# Altium schematic sheet Regulador 3v3.SchDoc
size A
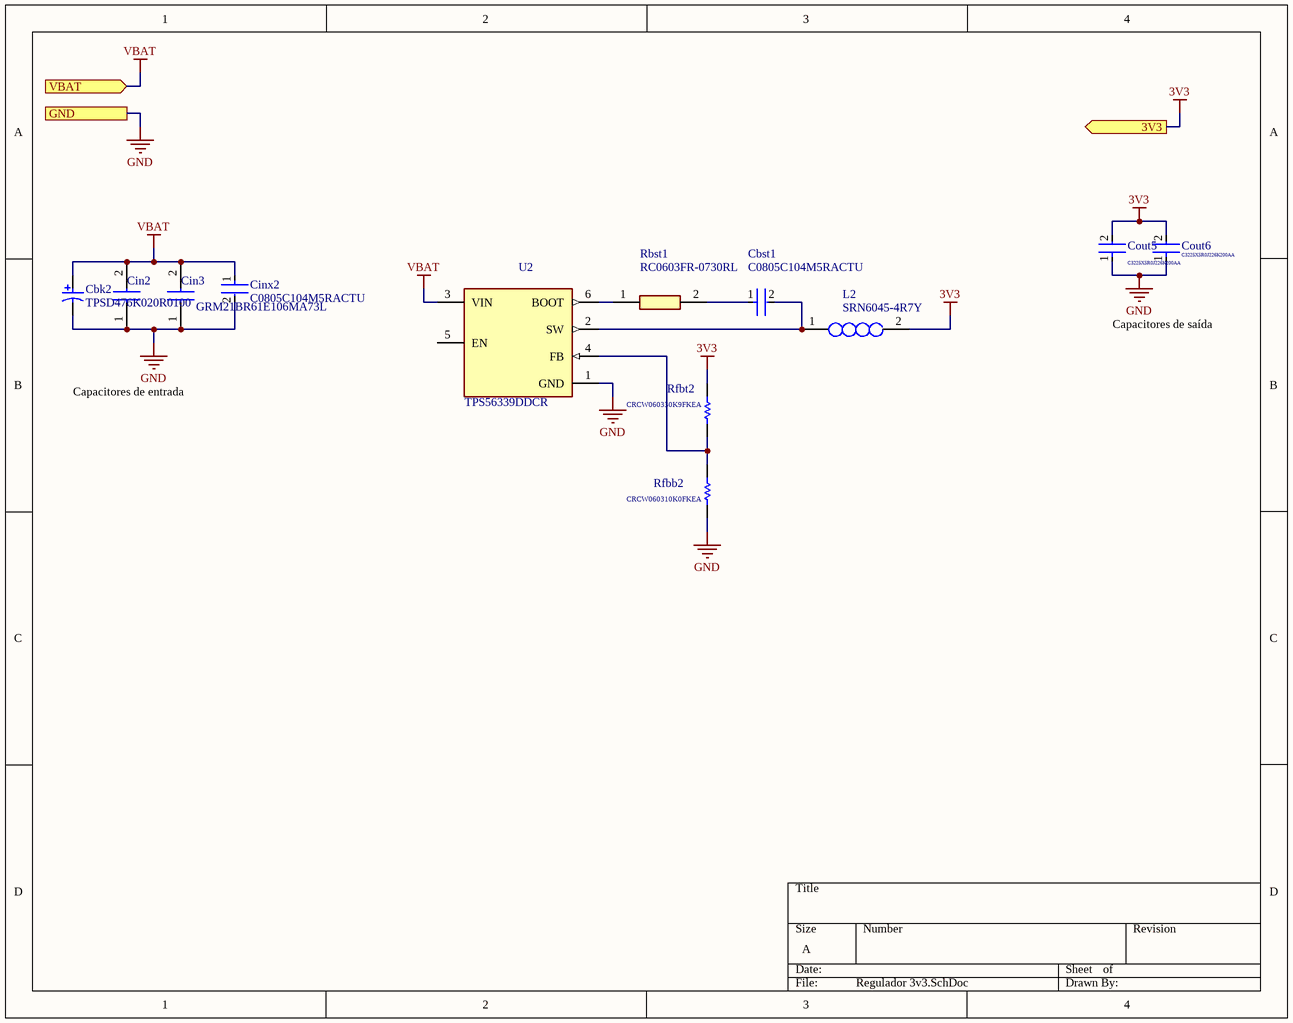
[diagram p0: Regulador 3v3.SchDoc]

## Parts
Cbk2  TPSD476K020R0100  [TPSD476K020R0100]
Cbst1  C0805C104M5RACTU  [FP-C0805C-DN-MFG]
Cin2  GRM21BR61E106MA73L  [CAPC2012X145N]  (value not drawn)
Cin3  GRM21BR61E106MA73L  [CAPC2012X145N]
Cinx2  C0805C104M5RACTU  [FP-C0805C-DN-MFG]
Cout5  C3225X5R0J226K200AA  [FP-C3225-200-0_4-IPC_C]
Cout6  C3225X5R0J226K200AA  [FP-C3225-200-0_4-IPC_C]
L2  SRN6045-4R7Y  [SRN6045_1]
Rbst1  RC0603FR-0730RL  [RESC1608X55N]
Rfbb2  CRCW060310K0FKEA  [RESC1609X50X30NL8T20]
Rfbt2  CRCW060330K9FKEA  [RESC1609X50X30LL10T20]
U2  TPS56339DDCR  [FP-DDC0006A-MFG]

## Ports
3V3 (out), GND, VBAT (in)

## Nets
3V3: Cout5.2 Cout6.2 L2.2 Rfbt2.2 ; port 3V3
GND: Cbk2.2 Cin2.1 Cin3.1 Cinx2.2 Cout5.1 Cout6.1 Rfbb2.2 U2.1(GND) ; port GND
VBAT: Cbk2.1 Cin2.2 Cin3.2 Cinx2.1 U2.3(VIN) ; port VBAT
NetCbst1_1: Cbst1.1 Rbst1.2
NetCbst1_2: Cbst1.2 L2.1 U2.2(SW)
NetRbst1_1: Rbst1.1 U2.6(BOOT)
NetRfbb2_1: Rfbb2.1 Rfbt2.1 U2.4(FB)

Not connected (* = marked no-connect by the designer): U2 5(EN)

## Notes on the sheet
- Capacitores de saída
- Capacitores de entrada

## Library data of the parts
Cbk2 = TPSD476K020R0100: CAP TANT 47UF 20V 10% 2917; Manufacturer: Kyocera AVX; Dielectric Material: Tantalum; ESR (Equivalent Series Resistance): 100mR; Leakage Current: 9.4uA; Polarity: Polar; Dissipation Factor: 6%; Ripple Current: 490uA; Supplier 1: Arrow Electronics; Manufacturer Part Number: TPSD476K020R0100; RoHS: Yes; Category: Tantalum Capacitors; Stock 1: 2; Pricing 1: 1=1.88550, 10=1.55250, 25=1.53920, 50=1.52390, 100=1.08810, 1000=1.02300 (USD); Mount: Surface Mount; Case/Package: 2917; Weight: 0.023634oz; Case Code (Imperial): 2917; Case Code (Metric): 7343; Min Operating Temperature: -55°C; Max Operating Temperature: 125°C; Capacitance: 47uF; Tolerance: 10%; Termination: SMD/SMT; Voltage: 20V; Features: General Purpose; Packaging: Tape and Reel; Voltage Rating: 20V; Package Quantity: 1; Length: 7.3mm; Height: 2.9mm; Depth: 4.3mm; Height - Seated (Max): 0.122inch; Width: 4.3mm; Radiation Hardening: No; REACH SVHC: No SVHC; Lead Free: Lead Free; ComponentLink1URL: https://datasheet.ciiva.com/11794/0900766b80962b61-11794592.pdf?src-supplier=RSComponents; ComponentLink1Description: https://datasheet.ciiva.com/11794/0900766b80962b61-11794592.pdf?src-supplier=RSComponents; ComponentLink2URL: https://datasheet.ciiva.com/39121/1154520-39121511.pdf?src-supplier=Jameco; ComponentLink2Description: https://datasheet.ciiva.com/39121/1154520-39121511.pdf?src-supplier=Jameco; ComponentLink3URL: https://datasheet.ciiva.com/26787/tpsd476k020r0100-26787068.pdf?src-supplier=IIIC; ComponentLink3Description: https://datasheet.ciiva.com/26787/tpsd476k020r0100-26787068.pdf?src-supplier=IIIC; ComponentLink4URL: https://datasheet.ciiva.com/7713/1680477-7713477.pdf?src-supplier=Element14; ComponentLink4Description: https://datasheet.ciiva.com/7713/1680477-7713477.pdf?src-supplier=Element14; ComponentLink5URL: https://datasheet.ciiva.com/7713/1680477-7713478.pdf?src-supplier=Element14; ComponentLink5Description: https://datasheet.ciiva.com/7713/1680477-7713478.pdf?src-supplier=Element14; ComponentLink6URL: https://datasheet.ciiva.com/16632/tps-16632569.pdf?src-supplier=Avnet+Europe; ComponentLink6Description: https://datasheet.ciiva.com/16632/tps-16632569.pdf?src-supplier=Avnet+Europe; ComponentLink7URL: https://datasheet.ciiva.com/12910/tps-23028-12910555.pdf?src-supplier=Mouser; ComponentLink7Description: https://datasheet.ciiva.com/12910/tps-23028-12910555.pdf?src-supplier=Mouser; ComponentLink8URL: https://datasheet.ciiva.com/11232/tps-11232172.pdf?src-supplier=Avnet; ComponentLink8Description: https://datasheet.ciiva.com/11232/tps-11232172.pdf?src-supplier=Avnet; ComponentLink9URL: https://datasheet.ciiva.com/265/tps-265005.pdf?src-supplier=Digi-Key; ComponentLink9Description: https://datasheet.ciiva.com/265/tps-265005.pdf?src-supplier=Digi-Key; ComponentLink10URL: https://datasheet.ciiva.com/265/tps-265006.pdf?src-supplier=Digi-Key; ComponentLink10Description: https://datasheet.ciiva.com/265/tps-265006.pdf?src-supplier=Digi-Key; ComponentLink11URL: https://datasheet.ciiva.com/265/tps-265007.pdf?src-supplier=Digi-Key; ComponentLink11Description: https://datasheet.ciiva.com/265/tps-265007.pdf?src-supplier=Digi-Key
Cbst1 Cinx2 = CMP-03020-020207-1: CAP CER 0.1UF 50V X7R 0805; Manufacturer: KEMET; Tolerance: 0.2; Temperature Coefficient: 30ppm/°C; Capacitance: 0.10 μF; Value: 0.10 μF; Temperature: -55°C to +125°C; RoHS: TRUE; Temperature Range Low: -55°C; Device Class L3: Ceramic Capacitors; Manufacturer Part Number: C0805C104M5RACTU; Octopart: https://octopart.com/c0805c104m5ractu-kemet-129379; Ipc Land Pattern Name: CAPC200125X78; Mouser Description: Multilayer Ceramic Capacitors MLCC - SMD/SMT 50volts 0.1uF X7R 20%; Temperature Range High: +125°C; Material: Ceramic; Package: C0805C-DN; Temperature Characteristic: X7R; Automotive: No; ComponentLink2URL: https://content.kemet.com/datasheets/KEM_C1003_C0G_SMD.pdf; Device Class L1: Passive Components; ComponentLink2Description: Datasheet; Device Class L2: Capacitors; Voltage Rating: 50 V; Digikey Description: CAP CER 0.1UF 50V X7R 0805; Lead Free: Yes; Height: 0.88mm; Category: Cap
Cin2 Cin3 = GRM21BR61E106MA73L: Capacitor; Manufacturer_Name: Murata Electronics; Datasheet Link: https://componentsearchengine.com//GRM21BR61E106MA73L.pdf; Height: 1.45mm; Mouser2 Part Number: 81-GRM21BR61E106MA3L; Mouser2 Price/Stock: https://www.mouser.com/Search/Refine.aspx?Keyword=81-GRM21BR61E106MA3L; Manufacturer_Part_Number: GRM21BR61E106MA73L
Cout5 Cout6 = CMP-08246-003519-1: Multilayer Ceramic Capacitors 22uF ±10% 6.3V X5R SMD 1210; Case Code (Imperial): 1210; RoHS Compliant: Yes; Series: C; Number of Pins: 2; Depth: 2.5mm; Package Quantity: 1000; Length: 3.2mm; Termination: SMD/SMT; Capacitance: 22uF; Weight: 0.000564oz; Packaging: Tape and Reel; Dielectric Material: Ceramic; Min Operating Temperature: -55°C; Voltage Rating: 6.3V; Resistor Type: Ceramic; Case/Package: 1210; Voltage: 6.3V; Dielectric: X5R; Max Operating Temperature: 85°C; Tolerance: 10%; Thickness: 0.087inch; Case Code (Metric): 3225; Lead Free: Lead Free; Height: 2.5mm; Voltage Rating (DC): 6.3V; Mount: Surface Mount; Width: 0.098inch
L2 = SRN6045-4R7Y: Inductor; Manufacturer_Name: Bourns; Datasheet Link: https://www.bourns.com/data/global/pdfs/SRN6045.pdf; Manufacturer_Part_Number: SRN6045-4R7Y
Rbst1 = RC0603FR-0730RL: Resistor; Manufacturer_Name: YAGEO (PHYCOMP); Datasheet Link: http://www.yageo.com/documents/recent/PYu-RC0603_51_RoHS_L_v5.pdf; Height: 0.55mm; Manufacturer_Part_Number: RC0603FR-0730RL
Rfbb2 = CMP-1666-00005-4: Chip Resistor, 10 KOhm, +/- 1%, 100 mW, -55 to 155 degC, 0603 (1608 Metric), RoHS, Tape and Reel; Manufacturer: Vishay Semiconductor; Voltage Rating: 75 V; Max Operating Temperature: 155 degC; PackageDescription: 2-Pin Surface Mount Device, Body 1.575 x 0.85 mm; ComponentLink1Description: Manufacturer URL; RoHSCompliant: true; PackageReference: 0603; REACH SVHC: Unknown; Length: 1.55 mm; DatasheetVersion: 06/2012; Packaging: Tape and Reel; Min Operating Temperature: -55 degC; Mounting Technology: Surface Mount; ComponentLink2URL: https://datasheet.ciiva.com/11809/0900766b80d98afc-11809037.pdf; Height: 0.45 mm; ComponentLink2Description: Datasheet; Package Quantity: 5000; ComponentLink1URL: http://www.vishay.com/
Rfbt2 = CMP-2000-03227-1: Manufacturer: Vishay Dale; Part Number: CRCW060330K9FKEA
U2 = CMP-04918-000012-1: PWR MGMT SPECIALIZED REGULATOR; Manufacturer: Texas Instruments; Output Type: AdjustableProgrammable; Max Supply Voltage: 24V; Min Supply Voltage: 4.5V; Nominal Supply Current: 98uA; Max Duty Cycle: 97%; Number Of Outputs: 1; Output Current: 3A; Switching Topology: Buck; Standoff Height: 0mm; Switching Frequency: 500kHz; Output Voltage: 0.8-16V; Max Junction Temp: +125°C; ComponentLink2Description: Datasheet; ComponentLink2URL: http://www.ti.com/lit/ds/symlink/tps56339.pdf; Package: DDC0006A; RoHS: TRUE; Temperature: -40°C to +125°C; Temperature Range Low: -40°C; Device Class L3: Voltage Regulators - Switching; Temperature Range High: +125°C; Device Class L2: Power Management ICs; Device Class L1: Integrated Circuits (ICs); Category: IC; Manufacturer Part Number: TPS56339DDCR; Octopart: https://octopart.com/tps56339ddcr-texas+instruments-101466410; Automotive: No; Height: 1.1mm; Digikey Description: PWR MGMT SPECIALIZED REGULATOR; Lead Free: Yes; Mouser Description: 4.5-V to 24-V input, 3-A output synchronous buck converter 6-SOT-23-THIN -40 to 125